# EAGLE schematic T10_Receiver (EAGLE 7.2.0)
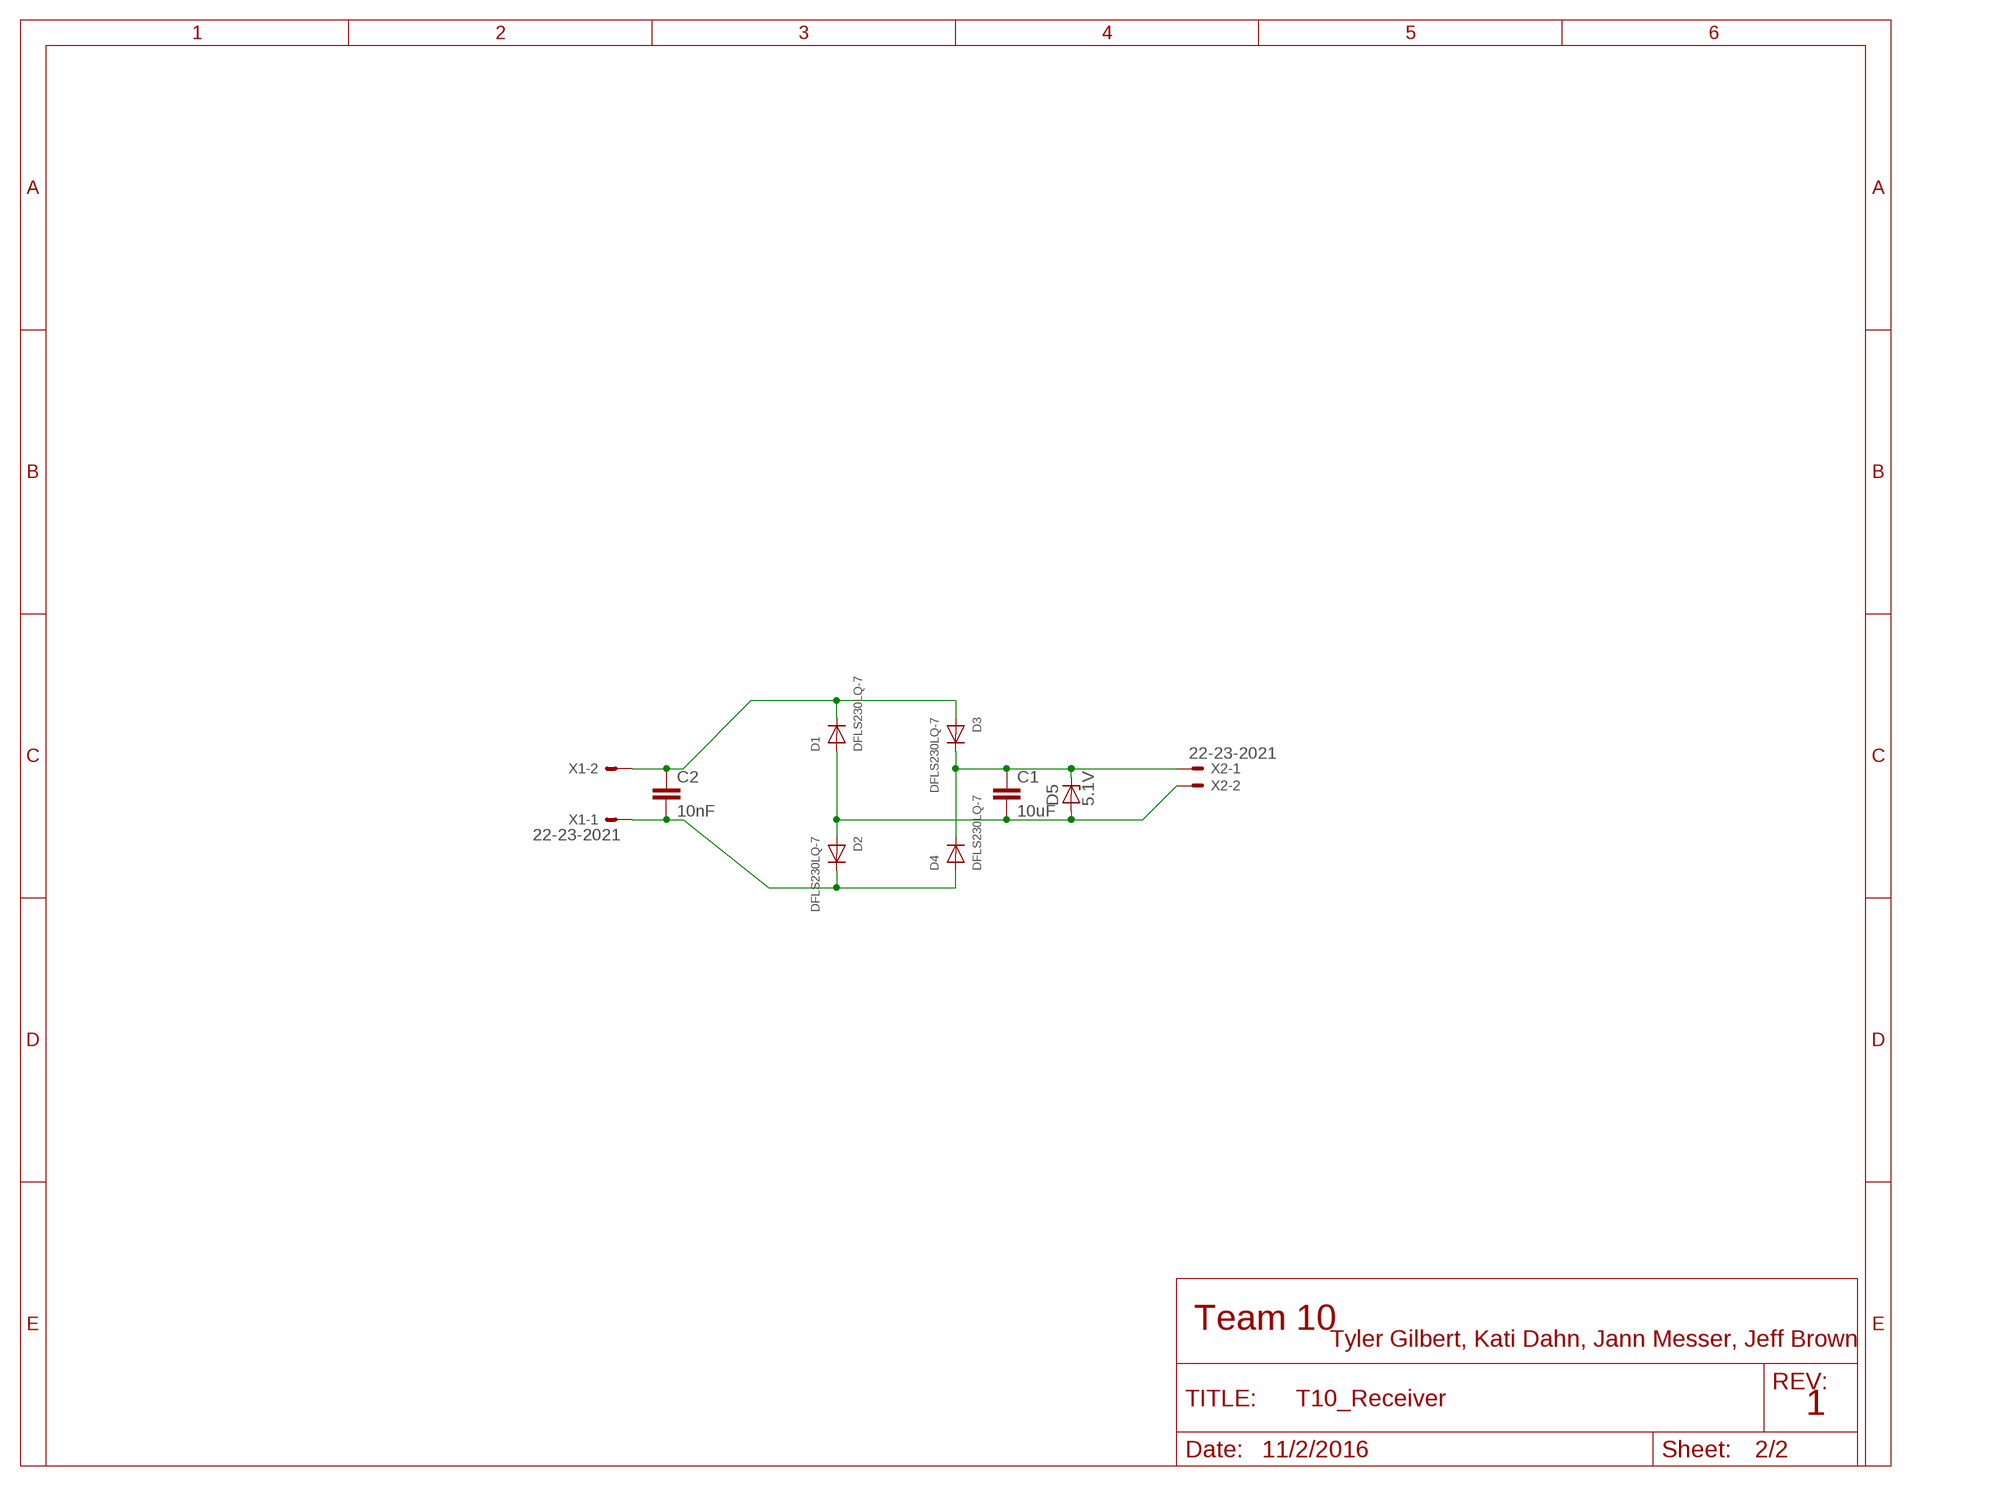
[diagram p0: schematic, sheet 1]

## Parts
C1  10uF  C-EU025-030X050  [C025-030X050]
C2  10nF  C-EU025-030X050  [C025-030X050]
D1  DFLS230LQ-7  DIODESOD-523  [SOD-523]
D2  DFLS230LQ-7  DIODESOD-523  [SOD-523]
D3  DFLS230LQ-7  DIODESOD-523  [SOD-523]
D4  DFLS230LQ-7  DIODESOD-523  [SOD-523]
D5  5.1V  BZX84CSMD  [TO236]
X1  22-23-2021  [22-23-2021]
X2  22-23-2021  [22-23-2021]

## Nets
N$1: C2.1 D1.K(C) D3.A X1.2
N$2: C2.2 D2.K(C) D4.A X1.1
N$3: C1.2 D1.A D2.A D5.A X2.2
N$4: C1.1 D3.K(C) D4.K(C) D5.C X2.1

## Library data of the parts
C1 C2 = rcl:C-EU: CAPACITOR, European symbol
D1-D4 = adafruit:DIODE: Diode SMADIODE - SMA Surface Mount Package 20V 1A Schottky Diode Digikey: 641-1014-6-ND DO-1N4148 - Through Hole Small Current Diode SOD-123 20V 1 A (.5mV Vf) Schottky Diode - Digikey: MBRX120TPMSCT-ND SOD-323 10V 570mA (.38mV Vf, 3ns) Schottky Diode - Digikey: ZLLS410CT-ND SOD-523 30V 30mA Schottky Diode (RB751S-40TE61) - Digikey: RB751S-40TE61CT-ND SOT23-R/W - SOT23 Package (R = Solder Paste/Reflow Ovens, W = Hand-Soldering) BAT54Film 40V 300mA - Digikey: 497-7162-1-ND
D5 = diode:BZX84CSMD: Z DIODE
X1 X2 = con-molex:22-23-2021: .100" (2.54mm) Center Header - 2 Pin; MF: MOLEX; MPN: 22-23-2021; OC_FARNELL: 1462926; OC_NEWARK: 25C3832